# EAGLE design mvm1a (EAGLE 6.4)
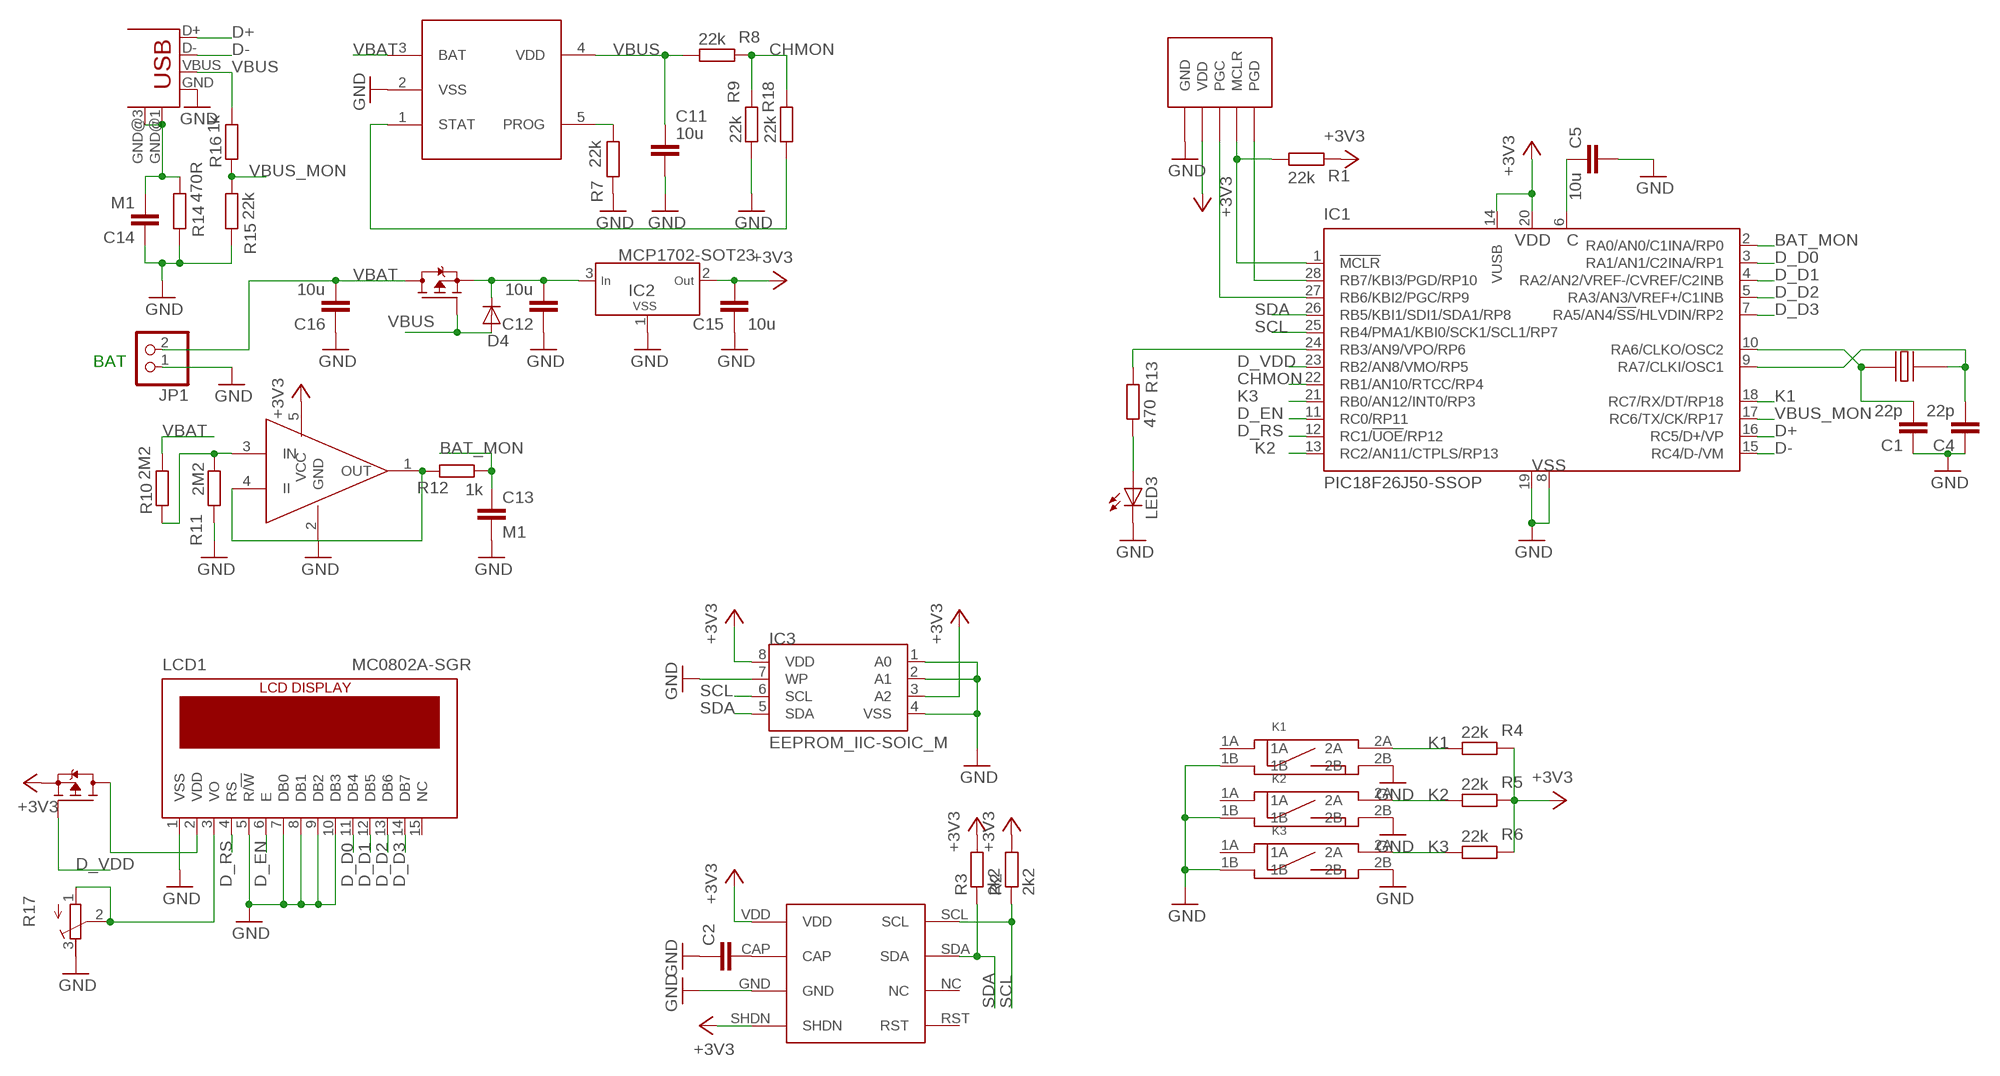
[diagram p0: schematic, sheet 1]

## Parts
C1  22p  C_0603  [0603]
C2  C_0603  [0603]
C4  22p  C_0603  [0603]
C5  10u  C_0806  [R0805]
C11  10u  C_0806  [R0805]
C12  10u  C_0806  [R0805]
C13  M1  C_0603  [0603]
C14  M1  C_0603  [0603]
C15  10u  C_0603  [0603]
C16  10u  C_0806  [R0805]
D4  DIODE-SOD123  [SOD123]
IC1  PIC18F26J50-SSOP  [SSOP28]
IC2  MCP1702-SOT23  [SOT23]
IC3  EEPROM_IIC-SOIC_M  [SO-08_208]
JP1  PINHD-1X02_2.54-90°  [1X02/90]
K1  SWITCH_BD_B  [SW_SMD2]
K2  SWITCH_BD_B  [SW_SMD2]
K3  SWITCH_BD_B  [SW_SMD2]
LCD1  MC0802A-SGR  [MC0802]
LED3  LEDCHIPLED_0805  [CHIPLED_0805]
R1  22k  R_0603  [0603]
R2  2k2  R_0603  [0603]
R3  2k2  R_0603  [0603]
R4  22k  R_0603  [0603]
R5  22k  R_0603  [0603]
R6  22k  R_0603  [0603]
R7  22k  R_0603  [0603]
R8  22k  R_0603  [0603]
R9  22k  R_0603  [0603]
R10  2M2  R_0603  [0603]
R11  2M2  R_0603  [0603]
R12  1k  R_0603  [0603]
R13  470  R_0603  [0603]
R14  470R  R_0603  [0603]
R15  22k  R_0603  [0603]
R16  1k  R_0603  [0603]
R17  R-TRIMM4G/J  [RTRIM4G/J]
R18  22k  R_0603  [0603]
U$1  PROGHEAD  [PROGHEAD_2]
U$2  BSS84  [SOT23-3]
U$3  MCP73831  [SOT23-5]
U$4  BSS84  [SOT23-3]
U$5  MCP6001  [SOT23-5]
U$6  MPL115A  [MPL115A]
USB2  USB-MB-S  [USB-MB-S]
X3  CRYST_TC26TC38  [TC38]

## Nets
+3V3: C15.2 IC1.14(VUSB) IC1.20(VDD) IC2.2(OUT) IC3.3(A2) IC3.8(VDD) R1.1 R2.2 R3.2 R4.1 R5.1 R6.1 U$1.VDD U$2.2(S) U$5.5(VCC) U$6.SHDN U$6.VDD
BAT_MON: C13.1 IC1.2(RA0/AN0/C1INA/RP0) R12.1
CHMON: IC1.22(RB1/AN10/RTCC/RP4) R8.1 R9.1 R18.1
D+: IC1.16(RC5/D+/VP) USB2.D+
D-: IC1.15(RC4/D-/VM) USB2.D-
D_D0: IC1.3(RA1/AN1/C2INA/RP1) LCD1.11(DB4)
D_D1: IC1.4(RA2/AN2/VREF-/CVREF/C2INB) LCD1.12(DB5)
D_D2: IC1.5(RA3/AN3/VREF+/C1INB) LCD1.13(DB6)
D_D3: IC1.7(RA5/AN4/!SS!/HLVDIN/RP2) LCD1.14(DB7)
D_EN: IC1.11(RC0/RP11) LCD1.6(E)
D_RS: IC1.12(RC1/!UOE!/RP12) LCD1.4(RS)
D_VDD: IC1.23(RB2/AN8/VMO/RP5) U$2.1(G)
GND: C1.1 C2.1 C4.1 C5.2 C11.2 C12.1 C13.2 C14.1 C15.1 C16.1 IC1.8(VSS) IC1.19(VSS) IC2.1(VSS) IC3.1(A0) IC3.2(A1) IC3.4(VSS) IC3.7(WP) JP1.1 K1.1B K1.2B K2.1B K2.2B K3.1B K3.2B LCD1.1(VSS) LCD1.5(R/!W) LCD1.7(DB0) LCD1.8(DB1) LCD1.9(DB2) LCD1.10(DB3) LED3.C R7.1 R9.2 R11.2 R14.1 R15.1 R17.3(A) U$1.GND U$3.2(VSS) U$5.2(GND) U$6.GND USB2.GND
K1: IC1.18(RC7/RX/DT/RP18) K1.2A R4.2
K2: IC1.13(RC2/AN11/CTPLS/RP13) K2.2A R5.2
K3: IC1.21(RB0/AN12/INT0/RP3) K3.2A R6.2
N$1: IC1.24(RB3/AN9/VPO/RP6) R13.2
N$5: IC1.28(RB7/KBI3/PGD/RP10) U$1.PGD
N$6: IC1.27(RB6/KBI2/PGC/RP9) U$1.PGC
N$7: IC1.1(!MCLR) R1.2 U$1.MCLR
N$8: LCD1.2(VDD) U$2.3(D)
N$9: C1.2 IC1.10(RA6/CLKO/OSC2) X3.P$1
N$10: C14.2 R14.2 USB2.GND@1(GND) USB2.GND@3(GND)
N$11: C12.2 D4.C IC2.3(IN) U$4.2(S)
N$12: R12.2 U$5.1(OUT) U$5.4(II)
N$13: R10.1 R11.1 U$5.3(IN)
N$14: C2.2 U$6.CAP
N$15: C4.2 IC1.9(RA7/CLKI/OSC1) X3.P$2
N$16: C5.1 IC1.6(VDDCORE/VCAP)
N$17: LED3.A R13.1
N$19: LCD1.3(VO) R17.1(E) R17.2(S)
N$78: R7.2 U$3.5(PROG)
N$80: R18.2 U$3.1(STAT)
SCL: IC1.25(RB4/PMA1/KBI0/SCK1/SCL1/RP7) IC3.6(SCL) R2.1 U$6.SCL
SDA: IC1.26(RB5/KBI1/SDI1/SDA1/RP8) IC3.5(SDA) R3.1 U$6.SDA
VBAT: C16.2 JP1.2 R10.2 U$3.3(BAT) U$4.3(D)
VBUS: C11.1 D4.A R8.2 R16.2 U$3.4(VDD) U$4.1(G) USB2.VBUS
VBUS_MON: IC1.17(RC6/TX/CK/RP17) R15.2 R16.1
Unconnected: K1.1A K2.1A K3.1A LCD1.15(NC) U$6.NC U$6.RST

## Notes on the sheet
- BAT

## Library data of the parts
C1 C2 C4 C5 C11-C16 = _moja:C
D4 = diode:DIODE-: DIODE
IC1 = _mcom4e:PIC18F26J50
IC2 = _mcom4:MCP1702
IC3 = _mcom4e:EEPROM_IIC
JP1 = pinhead-2:PINHD-1X02: PIN HEADER
K1-K3 = _moja:SWITCH_BD
LCD1 = _mcom4e:MC0802A-SGR
LED3 = led:LED: LED OSRAM: - CHIPLED LG R971, LG N971, LY N971, LG Q971, LY Q971, LO R971, LY R971 LH N974, LH R974 LS Q976, LO Q976, LY Q976 LO Q996 - Hyper CHIPLED LW Q18S LB Q993, LB Q99A, LB R99A - SideLED LS A670, LO A670, LY A670, LG A670, LP A670 LB A673, LV A673, LT A673, LW A673 LH A674 LY A675 LS A676, LA A676, LO A676, LY A676, LW A676 LS A679, LY A679, LG A679 - Hyper Micro SIDELED® LS Y876, LA Y876, LO Y876, LY Y876 LT Y87S - SmartLED LW L88C, LW L88S LB L89C, LB L89S, LG L890 LS L89K, LO L89K, LY L89K LS L896, LA L896, LO L896, LY L896 - TOPLED LS T670, LO T670, LY T670, LG T670, LP T670 LSG T670, LSP T670, LSY T670, LOP T670, LYG T670 LG T671, LOG T671, LSG T671 LB T673, LV T673, LT T673, LW T673 LH T674 LS T676, LA T676, LO T676, LY T676, LB T676, LH T676, LSB T676, LW T676 LB T67C, LV T67C, LT T67C, LS T67K, LO T67K, LY T67K, LW E67C LS E67B, LA E67B, LO E67B, LY E67B, LB E67C, LV E67C, LT E67C LW T67C LS T679, LY T679, LG T679 LS T770, LO T770, LY T770, LG T770, LP T770 LB T773, LV T773, LT T773, LW T773 LH T774 LS E675, LA E675, LY E675, LS T675 LS T776, LA T776, LO T776, LY T776, LB T776 LHGB T686 LT T68C, LB T68C - Hyper Mini TOPLED® LB M676 - Mini TOPLED Santana® LG M470 LS M47K, LO M47K, LY M47K Source: http://www.osram.convergy.de LUXEON: - LUMILED® LXK2-PW12-R00, LXK2-PW12-S00, LXK2-PW14-U00, LXK2-PW14-V00 LXK2-PM12-R00, LXK2-PM12-S00, LXK2-PM14-U00 LXK2-PE12-Q00, LXK2-PE12-R00, LXK2-PE12-S00, LXK2-PE14-T00, LXK2-PE14-U00 LXK2-PB12-K00, LXK2-PB12-L00, LXK2-PB12-M00, LXK2-PB14-N00, LXK2-PB14-P00, LXK2-PB14-Q00 LXK2-PR12-L00, LXK2-PR12-M00, LXK2-PR14-Q00, LXK2-PR14-R00 LXK2-PD12-Q00, LXK2-PD12-R00, LXK2-PD12-S00 LXK2-PH12-R00, LXK2-PH12-S00 LXK2-PL12-P00, LXK2-PL12-Q00, LXK2-PL12-R00 Source: www.luxeon.com KINGBRIGHT: KA-3528ASYC Source: www.kingbright.com
R1-R16 R18 = _moja:R
R17 = _rcl:R-TRIMM: Trimm resistor
U$1 = _moja:PROGHEAD
U$2 U$4 = _moja:BSS84
U$3 = _moja:MCP73831
U$5 = _moja:MCP6001
U$6 = SparkFun:MPL115A
USB2 = con-usb-2:USB: USB Connectors
X3 = _moja:CRYST_TC26

## Board
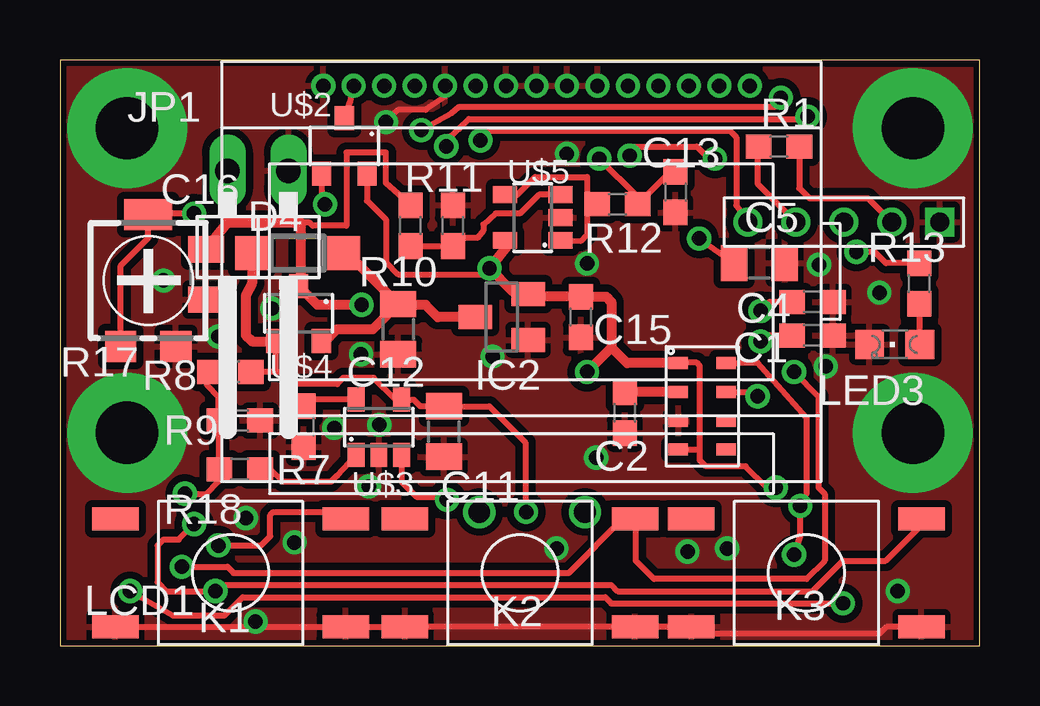
[diagram p1: board, top side]
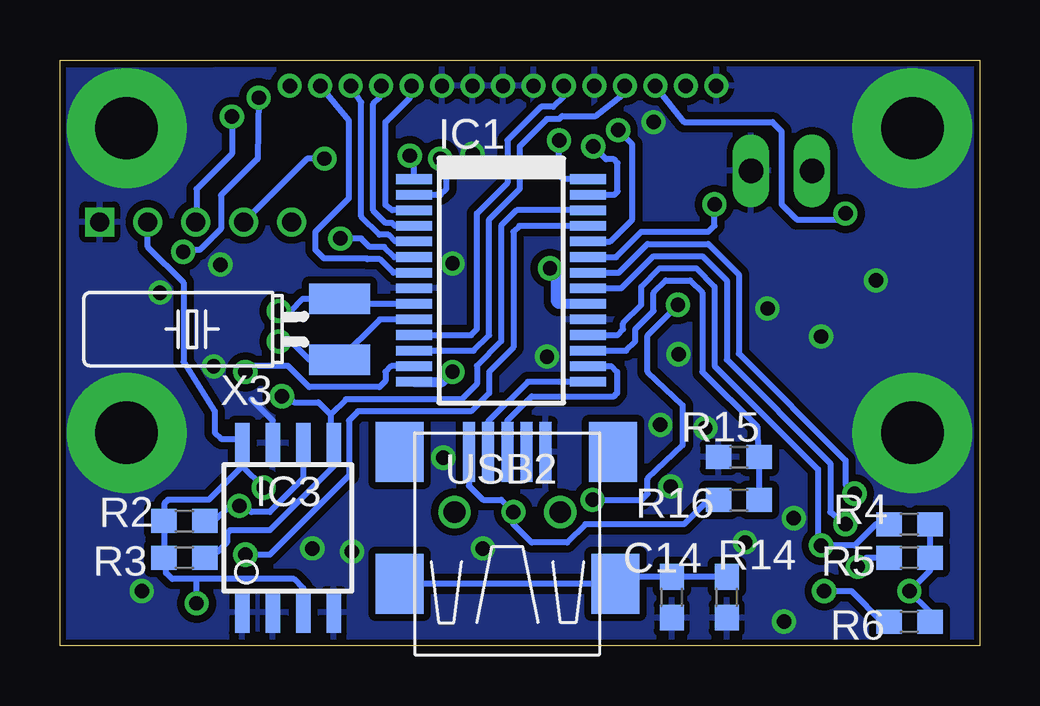
[diagram p2: board, bottom side, seen from below]

Size 38.33 x 24.43 mm. Coordinates in mm from the lower left corner, seen from the top.
Outline: 0,0 38.33,0 38.33,24.43 0,24.43 0,0
Copper layers (1*16): Top 0.035mm / dielectric 1.5mm / Bottom 0.035mm
Design rules "check12": minimum track width 8mil, minimum drill 23mil, track to track 12mil, track to pad 12mil, pad to pad 12mil, via to via 12mil, smd to smd 8mil, copper to edge 10mil, drill to drill 8mil, minimum pad ring 8mil, minimum via ring 8mil, stop-mask expansion 4mil, vias tented up to drill 0mil, thermal gap 10mil

### Footprints (pad centres in the part's own frame; a part is rotated, then mirrored left to right if it is on the bottom)
0603 = smd 1.067 x 1: 1 -0.85,0; 2 0.85,0
R0805 = smd 1.1 x 1.5: 1 -1.05,0; 2 1.05,0
SOD123 = smd 1.4 x 1.4: A 1.9,0; C -1.9,0
SSOP28 = smd 0.4 x 1.5: 1 -4.225,-3.625; 2 -3.575,-3.625; 3 -2.925,-3.625; 4 -2.275,-3.625; 5 -1.625,-3.625; 6 -0.975,-3.625; 7 -0.325,-3.625; 8 0.325,-3.625; 9 0.975,-3.625; 10 1.625,-3.625; 11 2.275,-3.625; 12 2.925,-3.625; 13 3.575,-3.625; 14 4.225,-3.625; 15 4.225,3.625; 16 3.575,3.625; 17 2.925,3.625; 18 2.275,3.625; 19 1.625,3.625; 20 0.975,3.625; 21 0.325,3.625; 22 -0.325,3.625; 23 -0.975,3.625; 24 -1.625,3.625; 25 -2.275,3.625; 26 -2.925,3.625; 27 -3.575,3.625; 28 -4.225,3.625
SOT23 = smd 1 x 1.4: 1 -0.95,-1.1; 2 0.95,-1.1; 3 0,1.1
SO-08_208 = smd 0.6 x 1.7: 1 -1.905,-3.43; 2 -0.635,-3.43; 3 0.635,-3.43; 4 1.905,-3.43; 5 1.905,3.63; 6 0.635,3.63; 7 -0.635,3.63; 8 -1.905,3.63
1X02/90 = drill 1.016 long: 1 -2.54,-3.81; 2 0,-3.81
SW_SMD2 = smd 1.93 x 0.965: 1A -4.8,2.25; 1B -4.8,-2.25; 2A 4.8,2.25; 2B 4.8,-2.25
MC0802 = drill 0.6 pad 1: 1 4.245,16.5; 2 5.515,16.5; 3 6.785,16.5; 4 8.055,16.5; 5 9.325,16.5; 6 10.595,16.5; 7 11.865,16.5; 8 13.135,16.5; 9 14.405,16.5; 10 15.675,16.5; 11 16.945,16.5; 12 18.215,16.5; 13 19.485,16.5; 14 20.755,16.5; 15 22.025,16.5
CHIPLED_0805 = smd 1.2 x 1.2: A 0,-1.05; C 0,1.05
RTRIM4G/J = smd 1.3 x 1.3: 1 -1.15,-2.75; 3 1.15,-2.75 | smd 2 x 1.3: 2 0,2.75
PROGHEAD_2 = drill 0.8 square: GND 0,0 | drill 0.8: MCLR 0,6; PGC 0,4; PGD 0,8; VDD 0,2
SOT23-3 = smd 0.8 x 1: 1 0.91,1.13; 2 -0.99,1.13; 3 -0.04,-1.17
SOT23-5 = smd 0.7 x 1: 1 -0.99,-1.17; 2 -0.04,-1.17; 3 0.91,-1.17; 4 0.91,1.13; 5 -0.99,1.13
MPL115A = smd 0.8 x 0.5: CAP 0.5,3.1; GND 0.5,1.9; NC 2.5,1.9; RST 2.5,0.7; SCL 2.5,4.3; SDA 2.5,3.1; SHDN 0.5,0.7; VDD 0.5,4.3
USB-MB-S = smd 2.5 x 0.5: D+ 2.5,0; D- 2.5,0.8; GND 2.5,-1.6; ID 2.5,-0.8; VBUS 2.5,1.6 | smd 2.5 x 2: GND@1 -3,4.5; GND@2 2.5,4.5; GND@3 -3,-4.5; GND@4 2.5,-4.4 | drill 0.9: P$5 0,2.2; P$6 0,-2.2
TC38 = smd 1.27 x 2.54: P$1 -1.27,-4.572; P$2 1.27,-4.572

### Placement (x,y rotation side)
C1  31.37,12.95 180 top
C2  23.55,9.73 90 top
C4  31.37,14.35 180 top
C5  29.16,15.98 0 top
C11  16,8.94 270 top
C12  14.1,13.21 90 top
C13  25.65,18.92 270 top
C14  12.83,2.03 90 bottom
C15  21.72,13.72 90 top
C16  6.1,15.49 90 top
D4  9.91,16.38 180 top
IC1  19.94,15.24 270 bottom
IC2  18.41,13.72 90 top
IC3  28.83,4.83 0 bottom
JP1  6.99,16 180 top
K1  7.11,3.05 0 top
K2  19.18,3.05 0 top
K3  31.11,3.05 0 top
LCD1  6.73,6.86 0 top
LED3  34.8,12.57 90 top
R1  29.97,20.83 180 top
R2  33.15,5.21 180 bottom
R3  33.15,3.68 180 bottom
R4  2.92,5.08 180 bottom
R5  2.92,3.68 180 bottom
R6  2.92,1.02 180 bottom
R7  10.16,9.14 90 top
R8  7.11,11.43 0 top
R9  7.49,9.4 0 top
R10  14.61,17.53 90 top
R11  16.38,17.53 90 top
R12  23.24,18.41 180 top
R13  35.81,15.11 90 top
R14  10.54,2.03 90 bottom
R15  10.03,7.87 0 bottom
R16  10.03,6.1 180 bottom
R17  3.68,15.24 0 top
R18  7.49,7.37 0 top
U$1  36.68,17.68 90 top
U$2  11.81,20.83 180 top
U$3  13.34,9.14 0 top
U$4  9.91,13.84 180 top
U$5  19.68,17.91 90 top
U$6  25.27,7.49 0 top
USB2  19.68,5.59 90 bottom
X3  31.24,13.21 90 bottom

### Tracks (layer width: path | path; a pad name or v marks a point on that pad's centre or on a via)
+3V3  (via drill 0.6)
  Top 0.254: U$2.2 12.8,18.57 13.59,17.78 13.59,16 14.1,15.49 17.65,15.49 v17.91,15.75 | U$5.5 18.81,16.88 18.67,16.76 | v29.84,6.6 29.46,6.6 28.57,7.49 26.92,7.49 26.67,7.75 26.67,8.13 | v2.92,2.29 4.7,1.27 6.86,1.27 7.62,2.03 22.73,2.03 22.99,1.78 v32.64,1.78 | 18.89,14.77 19.36,14.77 IC2.2 19.61,14.57 | 26.67,8.13 26.67,11.68 26.54,11.81 25.79,11.81 U$6.VDD | U$6.SHDN 26.61,8.19 26.67,8.13 | R1.1 30.82,19.09 31.24,18.67 33.69,18.67 U$1.VDD
  Top 0.406: 18.81,16.88 v17.91,15.75 18.89,14.77 | 22.99,12.45 22.99,14.35 22.77,14.57 C15.2 19.61,14.57 | 22.99,12.45 v21.97,11.43 | U$6.VDD 23.64,11.79 22.99,12.45
  Bottom 0.254: 30.73,7.49 IC3.8 30.91,8.64 31.62,8.64 31.88,8.89 31.88,9.78 33.18,11.84 33.18,15.14 34.67,16.64 U$1.VDD | 30.73,7.49 v29.84,6.6 | IC3.3 28.19,2.41 28.57,2.79 32.64,2.79 | 32.64,2.79 33.66,2.79 33.91,3.05 33.91,3.98 R3.2 R2.2 | 30.73,7.49 32.13,6.1 33.83,6.1 33.98,5.94 33.98,5.22 R2.2 | v32.64,1.78 32.64,2.79 | 33.91,5.59 R2.2 | R4.1 R5.1 2.07,3.14 v2.92,2.29 2.07,1.44 R6.1
  Bottom 0.406: IC1.14 22.39,11.02 v21.97,11.43 | IC1.20 17.57,14.27 17.65,14.35 17.65,15.49 v17.91,15.75
BAT_MON  (via drill 0.6)
  Top 0.254: 23.75,18.58 R12.1 | R12.1 24.09,18.71 v22.48,20.32 | C13.1 25.45,19.77 R12.1
  Bottom 0.254: IC1.2 22.46,18.82 22.23,19.05 22.23,20.07 v22.48,20.32
CHMON  (via drill 0.6)
  Top 0.254: R8.1 6.13,10.88 6.6,10.41 6.6,9.44 R9.1 R18.1 6.6,7.33 6.6,6.86 6.1,6.35 v5.21,6.35
  Bottom 0.254: IC1.22 15.04,15.56 13.84,16.76 11.3,16.76 10.03,15.49 10.03,12.19 5.59,7.75 5.59,6.73 v5.21,6.35
D+
  Bottom 0.254: USB2.D+ 19.68,9.4 18.67,10.41 15.24,10.41 15.11,10.54 15.11,11.43 15.35,11.66 IC1.16
D-
  Bottom 0.254: IC1.15 18.83,11.02 20.48,9.36 USB2.D-
D_D0
  Bottom 0.254: IC1.3 24.49,18.16 24.77,18.39 24.77,21.84 23.75,22.86 23.75,23.03 LCD1.11
D_D1
  Bottom 0.254: IC1.4 24.38,17.53 24.5,17.64 24.75,17.64 25.27,18.16 25.27,22.61 25.02,22.86 25.02,23.03 LCD1.12
D_D2
  Bottom 0.254: LCD1.13 25.78,22.67 25.78,17.91 25.02,17.14 24.64,17.14 24.36,16.86 IC1.5
D_D3
  Bottom 0.254: LCD1.14 26.29,21.91 26.29,18.67 27.69,17.27 27.69,16.51 27.33,16.15 25.55,16.15 25.53,16.13 24.99,16.13 24.43,15.56 IC1.7
D_EN
  Bottom 0.254: IC1.11 21.2,12.96 20.95,13.21 20.95,18.03 19.68,19.3 19.68,21.08 18.29,22.48 17.78,22.48 17.33,22.93 LCD1.6
D_RS
  Bottom 0.254: IC1.12 21.09,12.31 20.45,12.95 20.45,17.78 19.18,19.05 19.18,20.83 18.03,21.97 17.53,21.97 17.4,22.1 16,22.1 14.86,22.99 14.86,23.03 LCD1.4
D_VDD  (via drill 0.6)
  Top 0.254: U$2.1 10.9,18.56 v11.05,18.41
  Bottom 0.254: IC1.23 15.15,16.21 14.1,17.27 11.3,17.27 11.05,17.53 v11.05,18.41
GND  (via drill 0.6, 2.6 pad 5)
  Top 0.254: K1.1B K1.2B K2.1B K2.2B K3.1B 26.54,0.76 26.8,0.51 34.16,0.51 34.45,0.8 K3.2B | LCD1.5 16.06,22.91 15.24,22.35 14.1,22.35 v13.59,21.84
  Bottom 0.254: IC3.7 29.46,9.4 30.35,10.29
  other vias: 12.88,6.65 11.43,9.09 18.03,12.06 20.7,4.06 21.97,15.95 21.13,20.52 8.84,14.07 6.6,12.9 4.32,15.24 34.16,14.73 31.65,15.9 7.75,5.33 12.55,12.17 27.81,4.06 34.92,2.29 2.79,8.89 35.56,8.89 35.56,21.59 2.79,21.59 26.16,3.94 9.78,4.32 31.93,11.66 22.35,7.85 8.15,1.02 13.31,9.22
  pour Top: 0.25,0 38.23,-0.13 38.23,24 0.25,24.13
  pour Bottom: 0.25,0 38.23,-0.13 38.23,24 0.25,24.13
K1  (via drill 0.6)
  Top 0.254: 11.56,5.27 K1.2A 11.62,5.59 8.89,5.59 8.76,5.46 8.76,4.57 8.38,4.19 v6.6,4.19
  Bottom 0.254: IC1.18 15.1,12.96 14.86,13.21 14.86,13.46 14.1,14.22 14.1,14.99 13.34,15.75 11.81,15.75 11.05,14.99 11.05,11.68 6.73,7.37 6.73,4.32 v6.6,4.19 5.21,4.19 4.32,5.08 R4.2
K2  (via drill 0.6)
  Top 0.254: v5.08,3.3 6.99,3.3 7.24,3.05 21.21,3.05 23.5,5.33 23.94,5.33 K2.2A 24,5.27 24,3.56 24.77,2.79 31.11,2.79 31.88,3.56 31.88,6.35 31.62,6.6 31.62,10.41 v30.61,11.43
  Bottom 0.254: IC1.13 24.53,11.66 24.77,11.43 24.77,11.05 25.02,10.79 27.94,10.79 28.83,11.68 30.35,11.68 v30.61,11.43 | R5.2 4.7,3.68 v5.08,3.3
K3  (via drill 0.6)
  Top 0.254: K3.2A 35.94,5.27 35.94,5.08 34.42,3.56 32.64,3.56 31.37,2.29 23.24,2.29 22.99,2.54 6.73,2.54 v6.48,2.29 4.45,2.29 4.06,2.67 4.06,4.19 4.32,4.45 4.95,4.45 v5.59,5.08
  Bottom 0.254: IC1.21 14.93,14.91 13.59,16.26 11.56,16.26 10.54,15.24 10.54,11.94 6.22,7.62 6.22,5.59 v5.59,5.08 | R6.2 4.06,1.02 5.33,2.29 v6.48,2.29
N$1  (via drill 0.6)
  Top 0.254: v15.06,21.51 16.33,22.23 16.64,22.48 29.79,22.48 v30.05,22.86 | R13.2 34.43,15.96 33.96,16.43 v33.2,16.43
  Bottom 0.254: IC1.24 15.39,16.86 14.48,17.78 14.48,20.9 v15.06,21.51 | v30.05,22.86 30.1,20.3 30.1,20.32 31.62,18.8 31.62,17.4 32.51,16.51 33.12,16.51 v33.2,16.43
N$5  (via drill 0.6)
  Top 0.254: v17.53,21.08 17.93,21.49 27.94,21.46 28.19,21.21 28.19,18.36 U$1.PGD
  Bottom 0.254: IC1.28 17.36,19.46 17.53,19.63 v17.53,21.08
N$6  (via drill 0.6)
  Top 0.254: v16.1,20.83 16.1,21.06 16.64,21.57 17.04,21.97 30.81,21.97 30.96,22.07 v31.17,22.07
  Bottom 0.254: v31.17,22.07 31.17,20.52 32.64,19.05 32.64,17.72 U$1.PGC | IC1.27 15.22,18.82 15.09,18.95 15.09,20.14 15.24,20.3 15.57,20.3 v16.1,20.83
N$7  (via drill 0.6)
  Top 0.254: R1.2 29.08,20.54 29.08,19.27 U$1.MCLR | v23.75,20.45 23.75,20.83 26.54,20.83 27.05,20.32 v27.3,20.32
  Bottom 0.254: IC1.1 23.56,20.12 v23.75,20.45 | v27.3,20.32 28.04,20.32 U$1.MCLR
N$8
  Top 0.254: U$2.3 12.11,22.71 LCD1.2
N$9  (via drill 0.6)
  Top 0.254: C1.2 29.46,12.95 v29.21,12.7
  Bottom 0.254: IC1.10 24.99,13.62 X3.P$1 27.94,11.94 28.7,12.7 v29.21,12.7
N$10
  Bottom 0.254: USB2.GND@1 USB2.GND@3 14.89,2.88 C14.2 R14.2
N$11
  Top 0.254: D4.C 12.44,15.91 | 14.38,13.97 C12.2 14.13,14.22 | U$4.2 11.02,12.67
  Top 0.406: 12.44,15.91 C12.2 13.05,13.21 11.56,13.21 11.02,12.67 | IC2.3 15.75,13.72 15.24,14.22 14.13,14.22
N$12
  Top 0.254: U$5.1 21.72,16.89 21.97,17.14 21.97,18.41 | U$5.4 19.07,18.82 19.81,19.56 21.97,19.56 21.97,18.41 | R12.2 21.97,18.41
N$13
  Top 0.254: R10.1 R11.1 16.73,17.02 17.4,17.02 17.65,17.32 17.65,17.58 18.16,18.03 19.18,18.03 19.96,18.82 U$5.3
N$14
  Top 0.406: U$6.CAP 23.56,10.59 C2.2
N$15  (via drill 0.6)
  Top 0.254: C4.2 29.59,14.35 v29.21,13.97
  Bottom 0.254: IC1.9 26.46,14.27 X3.P$2 28.22,14.48 28.73,13.97 v29.21,13.97
N$16  (via drill 0.6)
  Top 0.254: 26.64,17.02 v26.64,16.99 C5.1
  Bottom 0.254: IC1.6 24.39,16.21 24.82,16.64 25.43,16.64 25.78,16.99 v26.64,16.99
N$17
  Top 0.254: R13.1 35.81,12.61 LED3.A
N$19  (via drill 0.6)
  Top 0.254: v5.59,18.03 3.6,18.03 R17.2 3.68,17.02 2.53,15.87 R17.1
  Bottom 0.254: LCD1.3 13.39,23.17 12.32,21.84 8.64,21.84 8.26,21.46 8.26,18.41 7.62,17.78 5.84,17.78 v5.59,18.03
N$78
  Top 0.254: U$3.5 10.62,10.27 R7.2
N$80
  Top 0.254: R18.2 8.76,7.37 9.27,6.86 11.3,6.86 11.56,7.11 12.32,7.95 U$3.1
SCL  (via drill 0.6)
  Top 0.254: v30.61,3.81 30.86,4.57 v30.86,5.84 31.11,6.35 31.11,9.53 29.08,11.81 28.45,11.81 28.3,11.79 U$6.SCL
  Bottom 0.254: IC1.25 19.19,17.52 19.43,17.27 19.43,12.45 20.45,11.43 20.45,10.54 21.21,9.78 25.91,9.78 26.29,9.4 26.29,7.11 29.59,3.81 v30.61,3.81 | IC3.6 28.19,6.99 29.59,5.59 30.35,5.59 30.61,5.84 v30.86,5.84 31.24,5.84 31.88,5.21 R2.1
SDA  (via drill 0.6)
  Top 0.254: U$6.SDA 28.75,10.59 v29.08,10.41
  Bottom 0.254: IC1.26 19.3,18.16 19.94,17.53 19.94,12.7 20.95,11.68 20.95,10.92 21.59,10.29 26.42,10.29 27.05,9.65 | 27.05,9.65 27.05,8.58 IC3.5 26.92,7.49 29.59,4.83 31.24,4.83 31.37,4.7 31.37,4.32 31.75,3.94 32.04,3.94 R3.1 | v29.08,10.41 28.83,10.41 28.57,10.16 27.56,10.16 27.05,9.65
VBAT  (via drill 0.6)
  Top 0.254: 10.03,14.93 U$4.3 | R10.2 14.64,18.38 13.59,19.3 13.59,20.57 11.94,20.57 11.94,17.53 10.54,17.53 10.41,17.65 10.03,17.65 | U$3.3 14.24,6.84 14.86,6.22 16,6.22 v16.13,6.1
  Top 0.406: JP1.2 6.99,17.65 | 6.99,17.65 10.03,17.65 10.03,14.93 | C16.2 6.48,17.02 6.99,17.65 | v12.57,14.22 10.73,14.22 U$4.3
  Bottom 0.254: v12.57,14.22 13.84,12.95 13.84,11.43 12.37,10.03 12.37,8.38 13.84,6.99 13.84,6.35 14.1,6.1 v16.13,6.1
VBUS  (via drill 0.6)
  Top 0.254: 9.27,12.69 U$4.1 | U$4.1 | 9.14,11.43 9.27,11.43 9.78,10.92 11.56,10.92 11.81,11.18 13.08,11.18 13.98,10.27 U$3.4 14.74,10.27 15.01,10.01 15.98,10.01 C11.1 17.9,9.99 19.41,8.48 19.41,5.61 v19.43,5.59 | 9.14,11.43 R8.2 | U$4.1 9,11.45 9.14,11.43
  Top 0.406: D4.A 8.01,15.12 7.75,14.61 7.75,12.95 8,12.7 U$4.1
  Bottom 0.254: USB2.VBUS 21.29,6.68 20.7,6.1 19.94,6.1 v19.43,5.59 19.43,5.08 18.67,4.32 17.2,4.32 16.43,5.08 12.32,5.08 11.3,6.1 R16.2
VBUS_MON
  Bottom 0.254: IC1.17 14.74,12.31 14.35,12.7 14.35,13.21 13.59,13.97 13.59,14.73 13.08,15.24 12.06,15.24 11.56,14.73 11.56,11.43 9.27,9.14 9.27,8.67 R15.2 R16.1